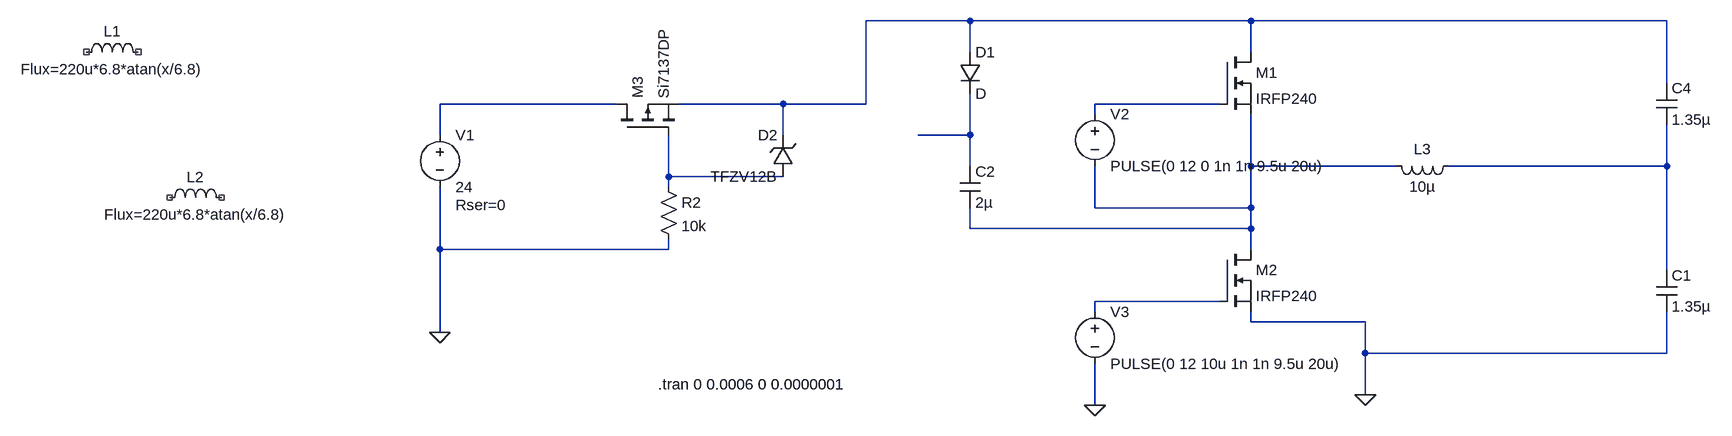
[diagram p0: schematic induction-heater llc convertish.asc]
induction-heater llc convertish.asc, the LTspice schematic file:
Version 4
SHEET 1 1608 680
WIRE 336 -48 176 -48
WIRE 768 -48 336 -48
WIRE 1408 -48 768 -48
WIRE 336 0 336 -48
WIRE 768 0 768 -48
WIRE 1408 48 1408 -48
WIRE -208 80 -480 80
WIRE 48 80 -112 80
WIRE 176 80 176 -48
WIRE 176 80 48 80
WIRE 720 80 528 80
WIRE 528 96 528 80
WIRE -480 128 -480 80
WIRE 48 128 48 80
WIRE 336 128 336 64
WIRE 336 128 256 128
WIRE 336 176 336 128
WIRE 768 176 768 96
WIRE 992 176 768 176
WIRE 1408 176 1408 112
WIRE 1408 176 1072 176
WIRE -128 192 -128 128
WIRE 48 192 -128 192
WIRE -128 208 -128 192
WIRE 528 240 528 176
WIRE 768 240 768 176
WIRE 768 240 528 240
WIRE 336 272 336 240
WIRE 768 272 768 240
WIRE 768 272 336 272
WIRE -480 304 -480 208
WIRE -128 304 -128 288
WIRE -128 304 -480 304
WIRE 768 304 768 272
WIRE 1408 336 1408 176
WIRE 720 384 528 384
WIRE 528 400 528 384
WIRE 768 416 768 400
WIRE 944 416 768 416
WIRE -480 432 -480 304
WIRE 944 464 944 416
WIRE 1408 464 1408 400
WIRE 1408 464 944 464
WIRE 944 528 944 464
WIRE 528 544 528 480
FLAG -480 432 0
FLAG 944 528 0
FLAG 528 544 0
SYMBOL ind -1040 16 R270
WINDOW 0 32 56 VTop 2
WINDOW 3 5 56 VBottom 2
SYMATTR InstName L1
SYMATTR Value Flux=220u*6.8*atan(x/6.8)
SYMATTR SpiceLine Rser=0.06
SYMBOL ind -912 240 R270
WINDOW 0 32 56 VTop 2
WINDOW 3 5 56 VBottom 2
SYMATTR InstName L2
SYMATTR Value Flux=220u*6.8*atan(x/6.8)
SYMATTR SpiceLine Rser=0.06
SYMBOL voltage -480 112 R0
WINDOW 123 0 0 Left 0
WINDOW 39 24 124 Left 2
SYMATTR SpiceLine Rser=0
SYMATTR InstName V1
SYMATTR Value 24
SYMBOL nmos 720 0 R0
SYMATTR InstName M1
SYMATTR Value IRFP240
SYMBOL nmos 720 304 R0
SYMATTR InstName M2
SYMATTR Value IRFP240
SYMBOL cap 1392 336 R0
SYMATTR InstName C1
SYMATTR Value 1.35µ
SYMATTR SpiceLine Rser=0.2
SYMBOL ind 1088 160 R90
WINDOW 0 5 56 VBottom 2
WINDOW 3 32 56 VTop 2
SYMATTR InstName L3
SYMATTR Value 10µ
SYMATTR SpiceLine Rser=0.02
SYMBOL voltage 528 80 R0
WINDOW 123 0 0 Left 0
WINDOW 39 0 0 Left 0
SYMATTR InstName V2
SYMATTR Value PULSE(0 12 0 1n 1n 9.5u 20u)
SYMBOL voltage 528 384 R0
WINDOW 123 0 0 Left 0
WINDOW 39 0 0 Left 0
SYMATTR InstName V3
SYMATTR Value PULSE(0 12 10u 1n 1n 9.5u 20u)
SYMBOL diode 320 0 R0
SYMATTR InstName D1
SYMBOL cap 320 176 R0
SYMATTR InstName C2
SYMATTR Value 2µ
SYMBOL cap 1392 48 R0
SYMATTR InstName C4
SYMATTR Value 1.35µ
SYMATTR SpiceLine Rser=0.2
SYMBOL pmos -208 128 R270
SYMATTR InstName M3
SYMATTR Value Si7137DP
SYMBOL res -144 192 R0
SYMATTR InstName R2
SYMATTR Value 10k
SYMBOL zener 64 192 R180
WINDOW 0 24 64 Left 2
WINDOW 3 24 0 Left 2
SYMATTR InstName D2
SYMATTR Value TFZV12B
TEXT -144 512 Left 2 !.tran 0 0.0006 0 0.0000001

The netlist it stands for:
* induction-heater llc convertish.asc
L1 NC_01 NC_02 Flux=220u*6.8*atan(x/6.8) Rser=0.06
L2 NC_03 NC_04 Flux=220u*6.8*atan(x/6.8) Rser=0.06
V1 N002 0 24 Rser=0
M1 N001 N003 N005 N005 IRFP240
M2 N005 N008 0 0 IRFP240
C1 N006 0 1.35µ Rser=0.2
L3 N006 N005 10µ Rser=0.02
V2 N003 N005 PULSE(0 12 0 1n 1n 9.5u 20u)
V3 N008 0 PULSE(0 12 10u 1n 1n 9.5u 20u)
D1 N001 N004 D
C2 N004 N005 2µ
C4 N001 N006 1.35µ Rser=0.2
M3 N002 N007 N001 N001 Si7137DP
R2 N007 0 10k
D2 N007 N001 TFZV12B
.model D D
.lib standard.dio
.model NMOS NMOS
.model PMOS PMOS
.lib standard.mos
.tran 0 0.0006 0 0.0000001
.backanno
.end